# EAGLE design pi1 (EAGLE 6.5.0)
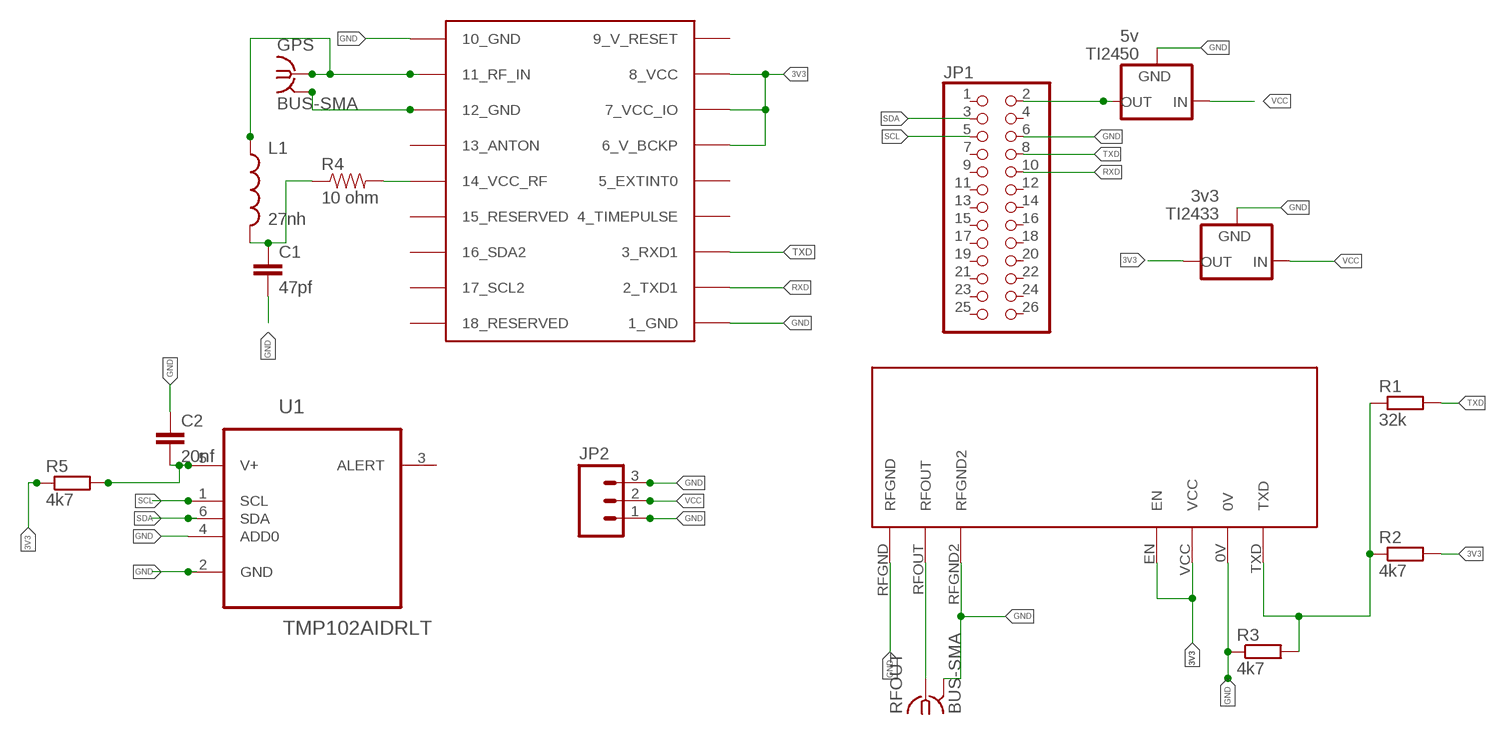
[diagram p0: schematic, sheet 1]

## Parts
C1  47pf  CAP0603-CAP  [0603-CAP]
C2  20nf  C-EUC0603  [C0603]
GPS  BUS-SMA  [BUS-SMA]
JP1  PINHD-2X13  [2X13]
JP2  M03PTH  [1X03]
L1  27nh  INDUCTOR0603  [0603]
R1  32k  R-EU_R0603  [R0603]
R2  4k7  R-EU_R0603  [R0603]
R3  4k7  R-EU_R0603  [R0603]
R4  10 ohm  RESISTOR0603  [0603-RES]
R5  4k7  R-EU_R0603  [R0603]
RFOUT  BUS-SMA  [BUS-SMA]
TI2433  3v3  V_REG_78XX-TO-220  [TO-220-ALT]
TI2450  5v  V_REG_78XX-TO-220  [TO-220-ALT]
U1  TMP102AIDRLT  [SOT50P160X60-6N]
U$1  NTX2  [NTX2]
U$2  UBLOX_MAX  [UBLOX_MAX]

## Nets
3V3: C2.2 R2.2 R5.1 R5.2 TI2433.OUT U1.5(V+) U$1.EN U$1.VCC U$2.6_V_BCKP U$2.7_VCC_IO U$2.8_VCC
GND: C1.2 C2.1 GPS.2(GND) GPS.3(GND) GPS.4(GND) GPS.5(GND) JP1.6 JP2.1 JP2.3 R3.1 RFOUT.2(GND) RFOUT.3(GND) RFOUT.4(GND) RFOUT.5(GND) TI2433.GND TI2450.GND U1.2(GND) U1.4(ADD0) U$1.0V U$1.RFGND U$1.RFGND2 U$2.1_GND U$2.10_GND U$2.12_GND
N$1: JP1.2 TI2450.OUT
N$2: R4.2 U$2.14_VCC_RF
N$3: C1.1 L1.2 R4.1
N$6: R1.1 R2.1 R3.2 U$1.TXD
N$9: RFOUT.1 U$1.RFOUT
N$13: GPS.1 L1.1 U$2.11_RF_IN
RXD: JP1.10 U$2.2_TXD1
SCL: JP1.5 U1.1(SCL)
SDA: JP1.3 U1.6(SDA)
TXD: JP1.8 R1.2 U$2.3_RXD1
VCC: JP2.2 TI2433.IN TI2450.IN
Unconnected: JP1.1 JP1.4 JP1.7 JP1.9 JP1.11 JP1.12 JP1.13 JP1.14 JP1.15 JP1.16 JP1.17 JP1.18 JP1.19 JP1.20 JP1.21 JP1.22 JP1.23 JP1.24 JP1.25 JP1.26 U1.3(ALERT) U$2.4_TIMEPULSE U$2.5_EXTINT0 U$2.13_ANTON U$2.15_RESERVED U$2.16_SDA2 U$2.17_SCL2 U$2.18_RESERVED

## Power pins joined to a net without a drawn wire
9_V_RESET: U$2.9_V_RESET

## Library data of the parts
C1 = SparkFun-Capacitors:CAP: Capacitor Standard 0603 ceramic capacitor, and 0.1" leaded capacitor.
C2 = rcl:C-EU: CAPACITOR, European symbol
GPS RFOUT = Ava:BUS-SMA
JP1 = pinhead:PINHD-2X13: PIN HEADER
JP2 = SparkFun-Connectors:M03: Header 3 Standard 3-pin 0.1" header. Use with straight break away headers (SKU : PRT-00116), right angle break away headers (PRT-00553), swiss pins (PRT-00743), machine pins (PRT-00117), and female headers (PRT-00115). Molex polarized connector foot print use with SKU : PRT-08232 with associated crimp pins and housings.
L1 = SparkFun-Passives:INDUCTOR: Inductors Basic Inductor/Choke - 0603 and 1206. Footprints are not proven and vary greatly between part numbers. SRN6045- 33uH, 20% 1.4A SDR0403-560KL - 56uH, 10%, 500mA RMS/740mA peak
R1-R3 R5 = rcl:R-EU_: RESISTOR, European symbol
R4 = SparkFun-Resistors:RESISTOR: Resistor Basic schematic elements and footprints for 0603, 1206, and PTH resistors.
TI2433 TI2450 = SparkFun-PowerIC:V_REG_78XX: Voltage Regulator Standard 7805 5V regulator. IGO (Input Ground Output). Spark Fun Electronics SKU : COM-00107
U1 = Ava:TMP102AIDRLT: Temperature Sensor; MPN: TMP102AIDRLT; OC_FARNELL: 1652477; OC_NEWARK: 53M3987; PACKAGE: SOT-23-6; SUPPLIER: Texas Instruments
U$1 = Ava:NTX2: Radiometrix NTX2 Transmitter Module Author Anthony Stirk / http://ava.upuaut.net
U$2 = Ava:UBLOX_MAX: UBLOX MAX

## Net classes
0 default: clearance 0.205 mm

## Board
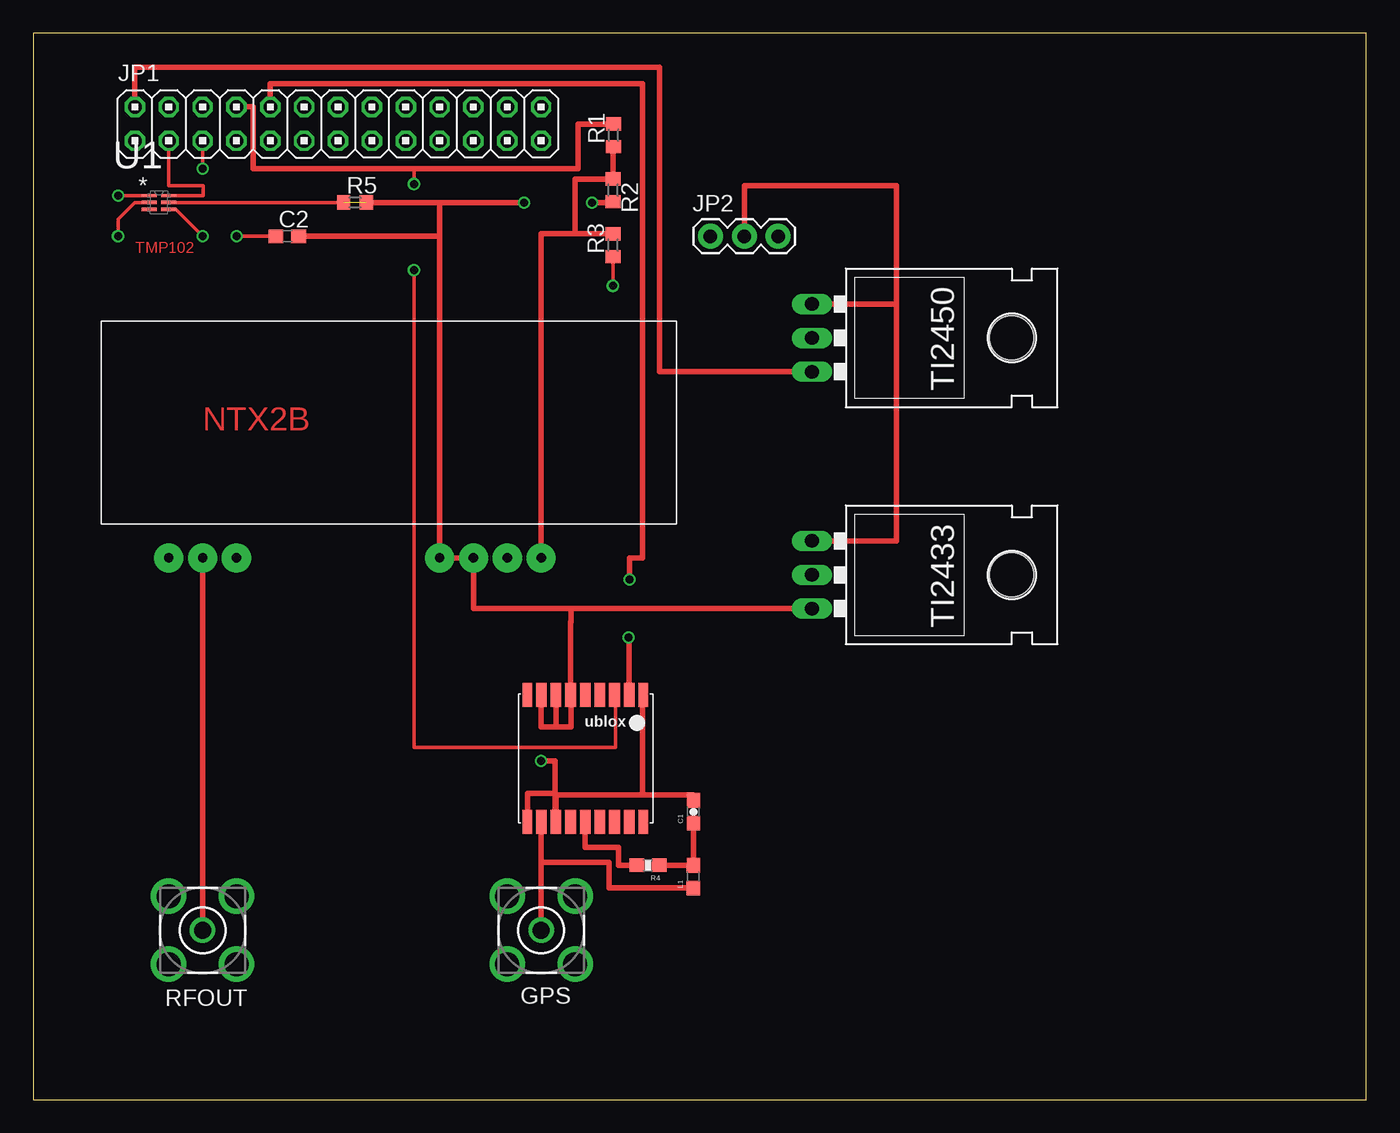
[diagram p1: board, top side]
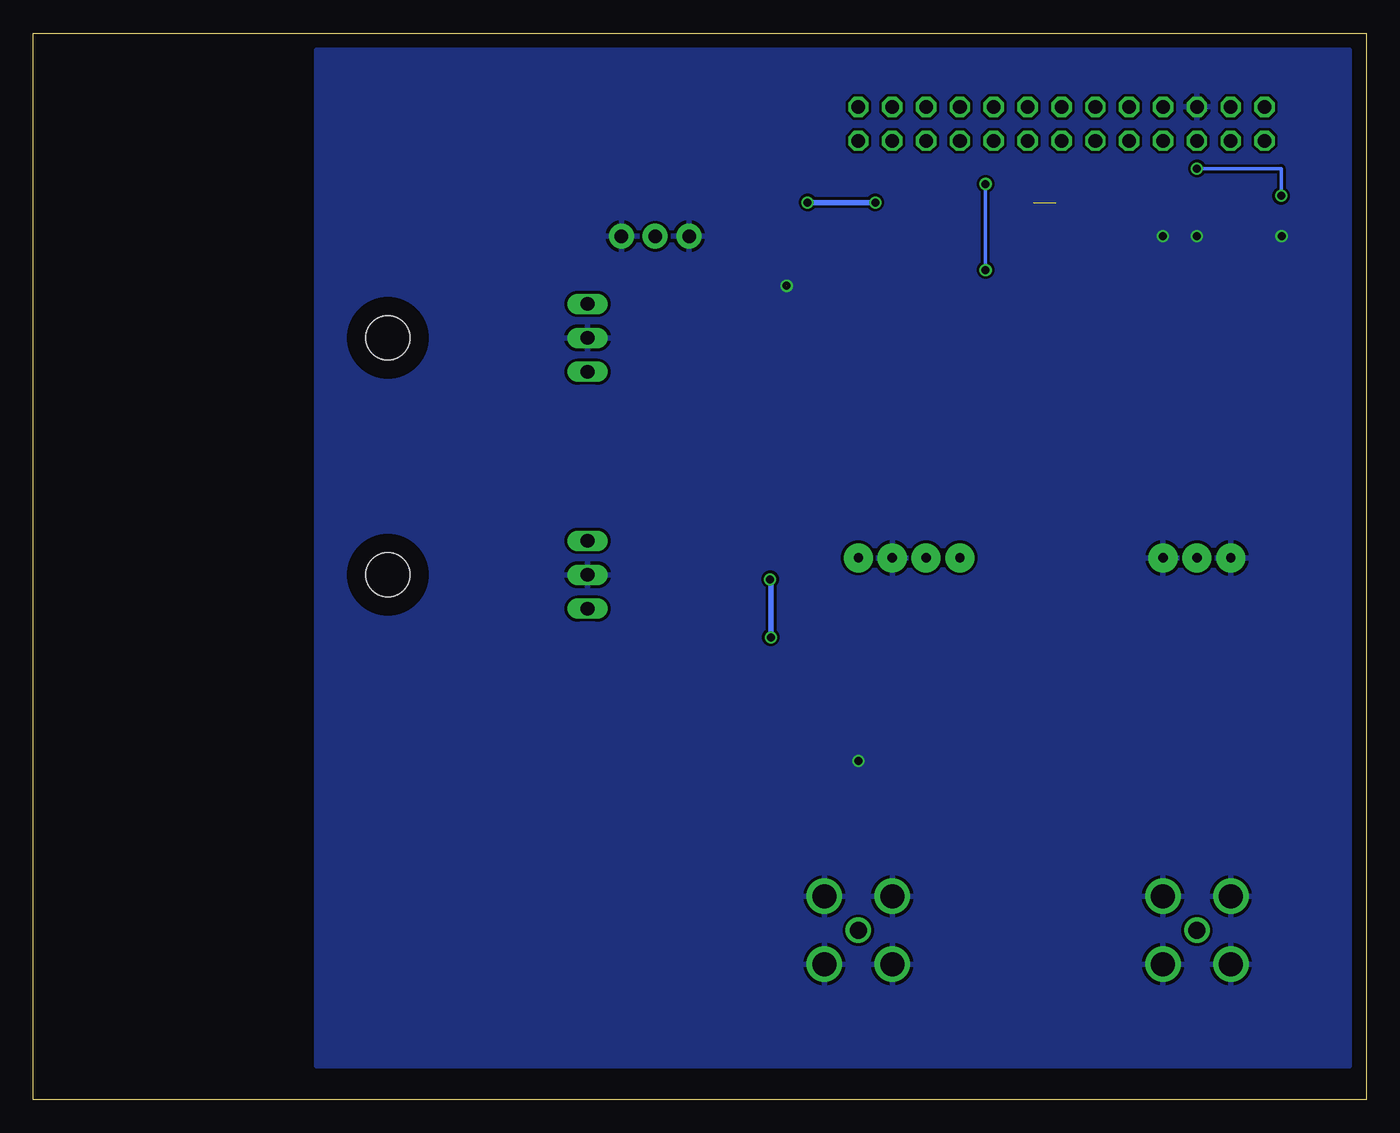
[diagram p2: board, bottom side, seen from below]

Size 100 x 80 mm. Coordinates in mm from the lower left corner, seen from the top.
Outline: 0,0 100,0 100,80 0,80 0,0
Copper layers (1*16): Top 0.035mm / dielectric 1.5mm / Bottom 0.035mm
Design rules "hackvana": minimum track width 6mil, minimum drill 0.3mm, track to track 6mil, track to pad 6mil, pad to pad 6mil, via to via 6mil, smd to smd 0mil, copper to edge 6mil, drill to drill 6mil, minimum pad ring 10mil, minimum via ring 6mil, stop-mask expansion 2mil, vias tented up to drill 100mil, thermal gap 10mil

### Footprints (pad centres in the part's own frame; a part is rotated, then mirrored left to right if it is on the bottom)
0603-CAP = smd 1.1 x 1: 1 -0.85,0; 2 0.85,0
C0603 = smd 1.1 x 1: 1 -0.85,0; 2 0.85,0
BUS-SMA = drill 1.27: 1 0,0 | drill 1.778: 2 -2.55,2.55; 3 2.55,2.55; 4 2.55,-2.55; 5 -2.55,-2.55
2X13 = drill 1.016 octagon: 1 -15.24,-1.27; 2 -15.24,1.27; 3 -12.7,-1.27; 4 -12.7,1.27; 5 -10.16,-1.27; 6 -10.16,1.27; 7 -7.62,-1.27; 8 -7.62,1.27; 9 -5.08,-1.27; 10 -5.08,1.27; 11 -2.54,-1.27; 12 -2.54,1.27; 13 0,-1.27; 14 0,1.27; 15 2.54,-1.27; 16 2.54,1.27; 17 5.08,-1.27; 18 5.08,1.27; 19 7.62,-1.27; 20 7.62,1.27; 21 10.16,-1.27; 22 10.16,1.27; 23 12.7,-1.27; 24 12.7,1.27; 25 15.24,-1.27; 26 15.24,1.27
1X03 = drill 1.016 pad 1.88: 1 0,0; 2 2.54,0; 3 5.08,0
0603 = smd 1.1 x 1: 1 -0.85,0; 2 0.85,0
R0603 = smd 1 x 1.1: 1 -0.85,0; 2 0.85,0
0603-RES = smd 1.1 x 1: 1 -0.85,0; 2 0.85,0
TO-220-ALT = drill 1.016 long: GND 0,-3.81; IN -2.54,-3.81; OUT 2.54,-3.81 | hole 3.302: 0,11.176
SOT50P160X60-6N = smd 1.118 x 0.254: 1 -0.737,0.508; 2 -0.737,0; 3 -0.737,-0.508; 4 0.737,-0.508; 5 0.737,0; 6 0.737,0.508
NTX2 = drill 0.7 pad 2.184: 0V -2.54,-10.16; EN -7.62,-10.16; RFGND -22.86,-10.16; RFGND2 -27.94,-10.16; RFOUT -25.4,-10.16; TXD 0,-10.16; VCC -5.08,-10.16
UBLOX_MAX = smd 1.8 x 0.7: 1_GND 4.95,-4.4; 9_V_RESET 4.95,4.3; 10_GND -4.55,4.3; 18_RESERVED -4.55,-4.4 | smd 1.8 x 0.8: 2_TXD1 4.95,-3.35; 3_RXD1 4.95,-2.25; 4_TIMEPULSE 4.95,-1.15; 5_EXTINT0 4.95,-0.05; 6_V_BCKP 4.95,1.05; 7_VCC_IO 4.95,2.15; 8_VCC 4.95,3.25; 11_RF_IN -4.55,3.25; 12_GND -4.55,2.15; 13_ANTON -4.55,1.05; 14_VCC_RF -4.55,-0.05; 15_RESERVED -4.55,-1.15; 16_SDA2 -4.55,-2.25; 17_SCL2 -4.55,-3.35

### Placement (x,y rotation side)
C1  49.53,21.59 90 top
C2  19.05,64.77 0 top
GPS  38.1,12.7 0 top
JP1  22.86,73.21 0 top
JP2  50.8,64.77 0 top
L1  49.52,16.72 89.7 top
R1  43.53,72.35 90 top
R2  43.49,68.22 270 top
R3  43.49,64.09 90 top
R4  46.12,17.58 180 top
R5  24.13,67.31 0 top
RFOUT  12.7,12.7 0 top
TI2433  62.23,39.37 270 top
TI2450  62.23,57.15 270 top
U1  9.42,67.31 0 top
U$1  38.1,50.8 0 top
U$2  41.35,25.4 90 top

### Tracks (layer width: path | path; a pad name or v marks a point on that pad's centre or on a via)
3V3  (via drill 0.6)  (1 unrouted)
  Top 0.254: U1.5 R5.1
  Top 0.406: TI2433.OUT 40.34,36.83 | 40.34,36.83 40.34,35.84 40.3,35.84 U$2.6_V_BCKP 40.33,30.25 40.33,27.96 39.2,27.96 | U$2.8_VCC 38.11,30.25 38.11,27.96 39.2,27.96 | 39.2,27.96 U$2.7_VCC_IO | 40.34,36.83 33.02,36.83 U$1.VCC U$1.EN 30.48,64.77 | 30.48,64.77 C2.2 | R5.2 30.48,67.31 | 30.48,67.31 30.48,64.77 | 30.48,67.31 v36.83,67.31 | v41.91,67.31 43.49,67.31 R2.2
  Bottom 0.406: v36.83,67.31 v41.91,67.31
GND  (via drill 0.6)  (1 unrouted)
  Top 0.254: U1.2 7.62,67.31 6.35,66.04 v6.35,64.77 | U1.4 10.67,66.8 v12.7,64.77 | C2.1 v15.24,64.77 | R3.1 43.51,63.24 43.51,61.08
  Top 0.406: U$2.10_GND 37.07,20.75 37.07,22.98 39.17,22.98 39.17,22.86 39.2,22.86 | 39.2,22.86 U$2.12_GND 39.14,20.75 39.14,25.39 38.1,25.39 v38.1,25.4 | U$2.1_GND 45.72,30.25 45.72,22.86 | 45.72,22.86 39.2,22.86 | 45.72,22.86 49.53,22.86 C1.2
  other vias: 43.48,61.05
  pour Bottom: 1.27,78.74 78.74,78.74 78.74,11.43 78.74,2.54 1.27,2.54
N$1
  Top 0.406: TI2450.OUT 46.99,54.61 46.99,77.47 7.62,77.47 JP1.2
N$2
  Top 0.406: R4.2 44.02,17.58 43.92,17.58 43.92,18.92 41.4,18.92 U$2.14_VCC_RF
N$3
  Top 0.406: R4.1 L1.2 C1.1
N$6
  Top 0.406: R1.1 43.49,71.5 R2.1 40.64,69.07 40.64,64.95 | U$1.TXD | U$1.TXD 38.1,64.95 40.64,64.95 | 40.64,64.95 43.49,64.95 R3.2
N$9
  Top 0.406: U$1.RFOUT RFOUT.1
N$13
  Top 0.406: U$2.11_RF_IN 38.1,20.75 38.1,17.78 | 38.1,17.78 GPS.1 | L1.1 43.18,15.87 43.18,17.78 38.1,17.78
RXD  (via drill 0.6)
  Top 0.406: JP1.10 17.78,76.2 45.72,76.2 45.72,40.64 44.72,40.64 v44.72,39.02 | v44.67,34.67 44.7,34.67 U$2.2_TXD1
  Bottom 0.406: v44.72,39.02 44.67,39.02 v44.67,34.67
SCL  (via drill 0.6)
  Top 0.254: JP1.5 v12.7,69.85 | v6.38,67.81 U1.1
  Bottom 0.254: v12.7,69.85 6.38,69.85 v6.38,67.81
SDA
  Top 0.254: JP1.3 10.16,68.58 12.73,68.58 12.73,67.81 U1.6
  Top 0.406: JP1.3
TXD  (via drill 0.6)
  Top 0.254: U$2.3_RXD1 43.67,30.35 43.67,26.4 28.55,26.4 v28.55,62.24 | v28.55,68.7 28.55,69.85
  Top 0.406: JP1.8 16.51,74.48 16.51,69.85 28.55,69.85 40.88,69.85 40.88,73.19 R1.2
  Bottom 0.254: v28.55,62.24 v28.55,68.7
VCC
  Top 0.406: TI2450.IN 64.77,59.69 | 64.77,59.69 64.77,41.91 TI2433.IN | JP2.2 53.34,68.58 64.77,68.58 64.77,59.69

### Text on the board
Top: TMP102 | TMP102 | NTX2B